# EAGLE design LoopSup (EAGLE 6.6.0)
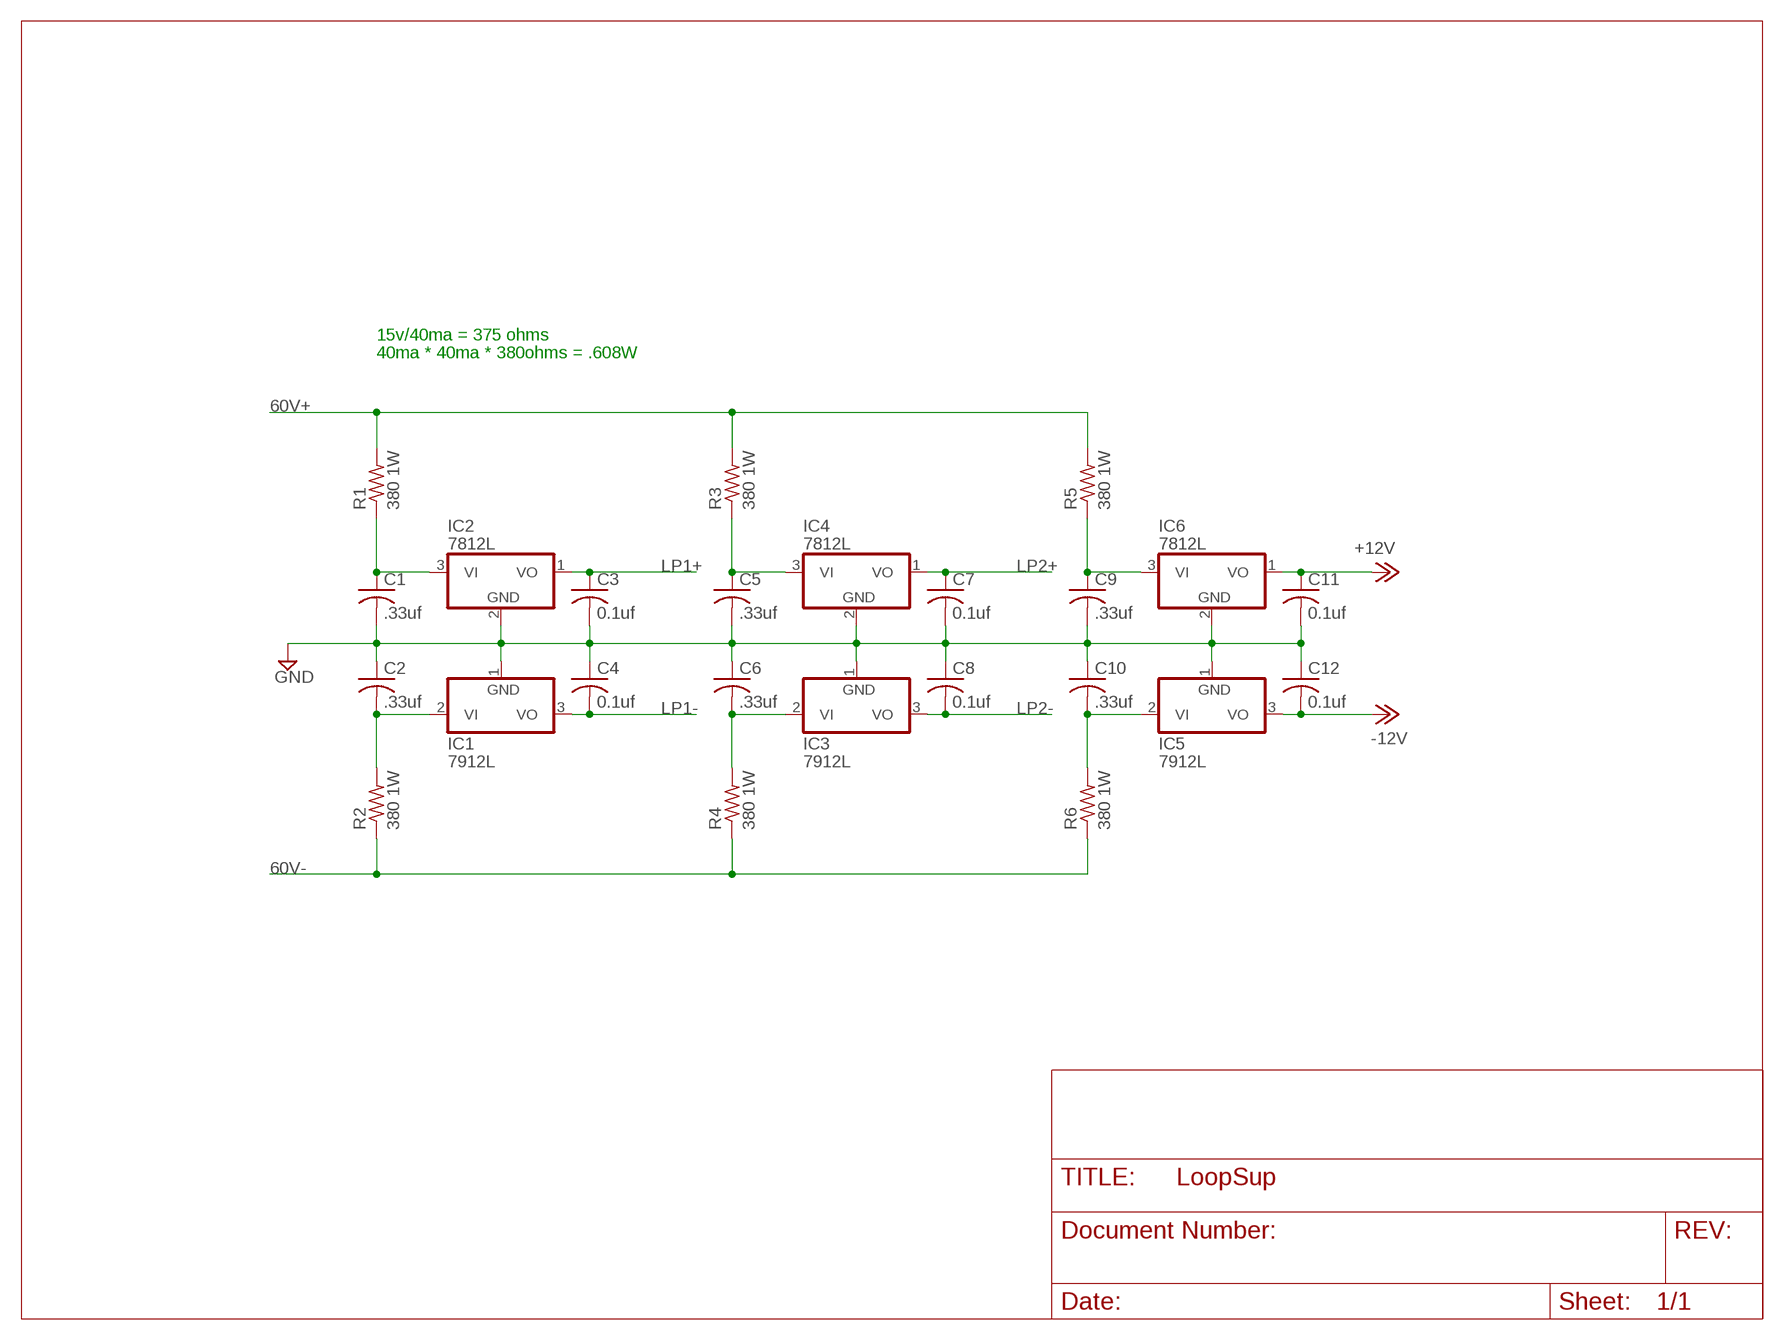
[diagram p0: schematic, sheet 1]

## Parts
C1  .33uf  C-US050-025X075  [C050-025X075]
C2  .33uf  C-US050-025X075  [C050-025X075]
C3  0.1uf  C-US050-025X075  [C050-025X075]
C4  0.1uf  C-US050-025X075  [C050-025X075]
C5  .33uf  C-US050-025X075  [C050-025X075]
C6  .33uf  C-US050-025X075  [C050-025X075]
C7  0.1uf  C-US050-025X075  [C050-025X075]
C8  0.1uf  C-US050-025X075  [C050-025X075]
C9  .33uf  C-US050-025X075  [C050-025X075]
C10  .33uf  C-US050-025X075  [C050-025X075]
C11  0.1uf  C-US050-025X075  [C050-025X075]
C12  0.1uf  C-US050-025X075  [C050-025X075]
IC1  7912L  [TO92]
IC2  7812L  [TO92]
IC3  7912L  [TO92]
IC4  7812L  [TO92]
IC5  7912L  [TO92]
IC6  7812L  [TO92]
R1  380 1W  R-US_0309/12  [0309/12]
R2  380 1W  R-US_0309/12  [0309/12]
R3  380 1W  R-US_0309/12  [0309/12]
R4  380 1W  R-US_0309/12  [0309/12]
R5  380 1W  R-US_0309/12  [0309/12]
R6  380 1W  R-US_0309/12  [0309/12]

## Nets
60V+: R1.2 R3.2 R5.2
60V-: R2.1 R4.1 R6.1
+12V: C11.1 IC6.1(VO)
-12V: C12.2 IC5.3(VO)
GND: C1.2 C2.1 C3.2 C4.1 C5.2 C6.1 C7.2 C8.1 C9.2 C10.1 C11.2 C12.1 IC1.1(GND) IC2.2(GND) IC3.1(GND) IC4.2(GND) IC5.1(GND) IC6.2(GND)
LP1+: C3.1 IC2.1(VO)
LP1-: C4.2 IC1.3(VO)
LP2+: C7.1 IC4.1(VO)
LP2-: C8.2 IC3.3(VO)
N$1: C6.2 IC3.2(VI) R4.2
N$2: C2.2 IC1.2(VI) R2.2
N$3: C1.1 IC2.3(VI) R1.1
N$4: C5.1 IC4.3(VI) R3.1
N$5: C10.2 IC5.2(VI) R6.2
N$6: C9.1 IC6.3(VI) R5.1

## Notes on the sheet
- 15v/40ma = 375 ohms
- 40ma * 40ma * 380ohms = .608W

## Library data of the parts
C1-C12 = rcl:C-US: CAPACITOR, American symbol
IC1 IC3 IC5 = linear:79*: Negative VOLTAGE REGULATOR
IC2 IC4 IC6 = linear:78*: Positive VOLTAGE REGULATOR Source: http://cache.national.com/ds/LM/LM78L05.pdf http://www.fairchildsemi.com/ds/LM/LM7805.pdf
R1-R6 = rcl:R-US_: RESISTOR, American symbol

## Board
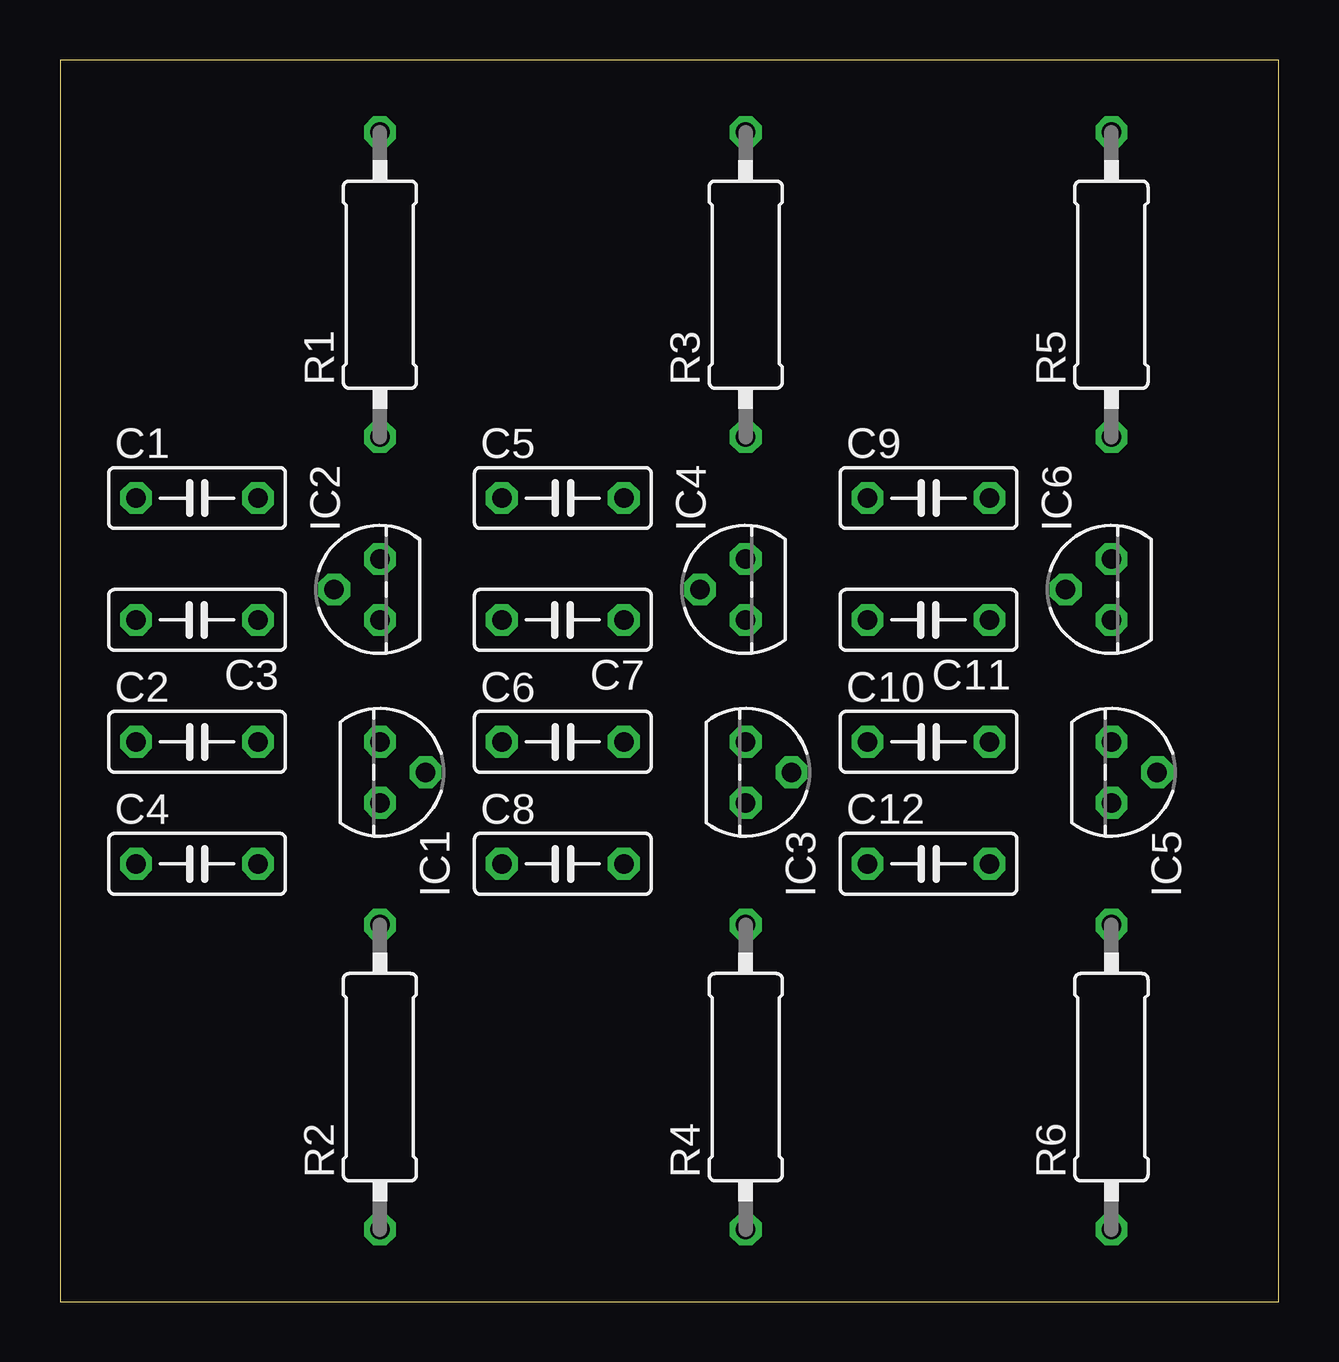
[diagram p1: board, top side]
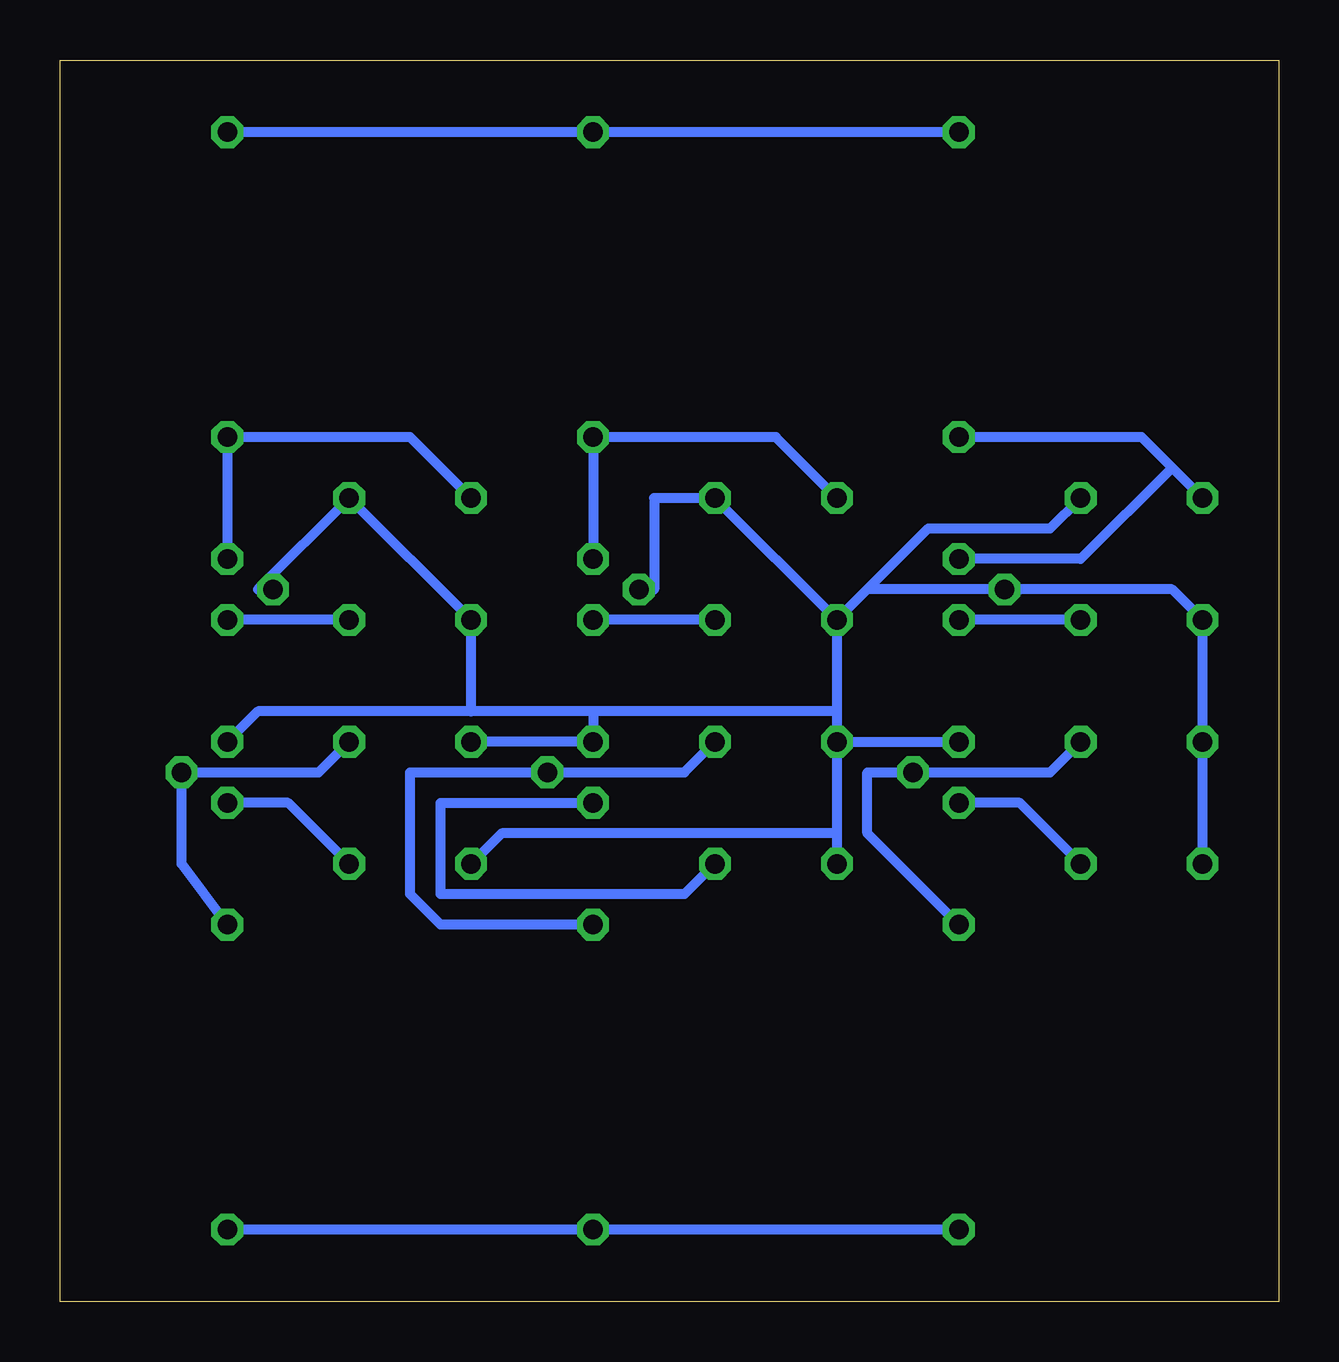
[diagram p2: board, bottom side, seen from below]

Size 50.78 x 51.74 mm. Coordinates in mm from the lower left corner, seen from the top.
Outline: 0,0 50.78,0 50.78,51.74 0,51.74 0,0
Copper layers (1+16): Top 0.035mm / dielectric 1.5mm / Bottom 0.035mm
Design rules "16mils": minimum track width 16mil, minimum drill 32mil, track to track 15mil, track to pad 10mil, pad to pad 10mil, via to via 10mil, smd to smd 10mil, copper to edge 13mil, drill to drill 10mil, minimum pad ring 10mil, minimum via ring 8mil, stop-mask expansion 0mil, vias tented up to drill 0mil, thermal gap 10mil

### Footprints (pad centres in the part's own frame; a part is rotated, then mirrored left to right if it is on the bottom)
C050-025X075 = drill 0.813 octagon: 1 -2.54,0; 2 2.54,0
TO92 = drill 0.813 octagon: 1 -1.27,0; 2 0,1.905; 3 1.27,0
0309/12 = drill 0.813 octagon: 1 -6.35,0; 2 6.35,0

### Placement (x,y rotation side)
C1  5.71,33.49 0 top
C2  5.71,23.33 0 top
C3  5.71,28.41 180 top
C4  5.71,18.25 0 top
C5  20.95,33.49 0 top
C6  20.95,23.33 0 top
C7  20.95,28.41 180 top
C8  20.95,18.25 0 top
C9  36.19,33.49 0 top
C10  36.19,23.33 0 top
C11  36.19,28.41 180 top
C12  36.19,18.25 0 top
IC1  13.33,22.06 270 top
IC2  13.33,29.68 90 top
IC3  28.57,22.06 270 top
IC4  28.57,29.68 90 top
IC5  43.81,22.06 270 top
IC6  43.81,29.68 90 top
R1  13.33,42.38 90 top
R2  13.33,9.36 90 top
R3  28.57,42.38 90 top
R4  28.57,9.36 90 top
R5  43.81,42.38 90 top
R6  43.81,9.36 90 top

### Tracks (layer width: path | path; a pad name or v marks a point on that pad's centre or on a via)
60V+
  Bottom 0.406: R1.2 R3.2 R5.2
60V-
  Bottom 0.406: R2.1 R4.1 R6.1
+12V
  Bottom 0.406: C11.1 IC6.1
-12V
  Bottom 0.406: C12.2 41.27,20.79 IC5.3
GND
  Bottom 0.406: C4.1 C2.1 C3.2 4.44,29.68 10.79,29.68 IC2.2 12.06,29.68 17.14,29.68 | IC6.2 42.54,29.68 C9.2 C11.2 33.65,24.6 | IC4.2 26.03,29.68 26.03,33.49 C5.2 C7.2 | C10.1 IC3.1 28.57,24.6 | C6.1 IC1.1 | C6.1 18.41,19.52 | 18.41,19.52 C8.1 | 18.41,24.6 C6.1 | C7.2 18.41,24.6 | C1.2 9.52,32.22 14.6,32.22 17.14,29.68 | 17.14,29.68 C7.2 | C12.1 32.38,19.52 18.41,19.52 | IC5.1 42.54,24.6 33.65,24.6 | 18.41,24.6 28.57,24.6 | 28.57,24.6 33.65,24.6
LP1+
  Bottom 0.406: C3.1 IC2.1
LP1-
  Bottom 0.406: C4.2 10.79,20.79 IC1.3
LP2+
  Bottom 0.406: C7.1 IC4.1
LP2-
  Bottom 0.406: C8.2 24.76,16.98 34.92,16.98 34.92,20.79 IC3.3
N$1
  Bottom 0.406: R4.2 34.92,15.71 36.19,16.98 36.19,22.06 31.11,22.06 IC3.2 29.84,22.06 24.76,22.06 C6.2
N$2
  Bottom 0.406: R2.2 17.14,19.52 17.14,22.06 15.87,22.06 IC1.2 14.6,22.06 9.52,22.06 C2.2
N$3
  Bottom 0.406: 4.44,34.76 5.71,36.03 R1.1 | C1.1 4.44,34.76 | IC2.3 8.25,30.95 4.44,34.76
N$4
  Bottom 0.406: C5.1 20.95,36.03 R3.1 IC4.3
N$5
  Bottom 0.406: R6.2 45.72,18.25 IC5.2 40,22.06 C10.2
N$6
  Bottom 0.406: C9.1 36.19,36.03 R5.1 IC6.3